# EAGLE design untitled (EAGLE 7.7.0)
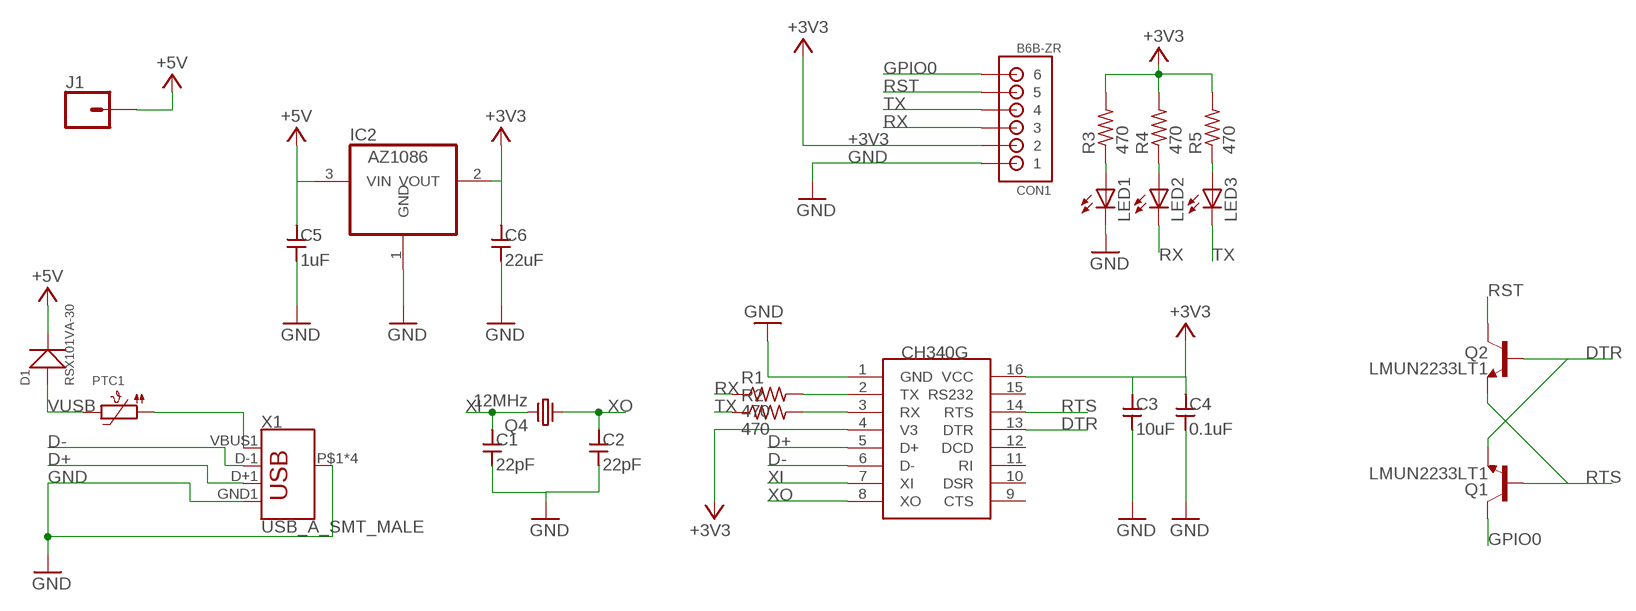
[diagram p0: schematic, sheet 1]

## Parts
C1  22pF  CAPACITOR1608  [SMD1608]
C2  22pF  CAPACITOR1608  [SMD1608]
C3  10uF  CAPACITOR1608  [SMD1608]
C4  0.1uF  CAPACITOR1608  [SMD1608]
C5  1uF  CAPACITOR1608  [SMD1608]
C6  22uF  CAPACITOR1608  [SMD1608]
CON1  B6B-ZR  [B6B-ZR]
D1  RSX101VA-30  DIODETUMD2  [TUMD2]
IC2  AZ1086  [SOT223]
J1  CONN_01PTH_NO_SILK_YES_STOP  [1X01_NO_SILK]
LED1  LEDCHIPLED_0603  [CHIPLED_0603]
LED2  LEDCHIPLED_0603  [CHIPLED_0603]
LED3  LEDCHIPLED_0603  [CHIPLED_0603]
PTC1  PTC0805  [0805]
Q1  LMUN2233LT1  [SOT23-3]
Q2  LMUN2233LT1  [SOT23-3]
Q4  12MHz  CRYSTAL-TC26H  [TC26H]
R1  470  R-US_R0603  [R0603]
R2  470  R-US_R0603  [R0603]
R3  470  R-US_R0603  [R0603]
R4  470  R-US_R0603  [R0603]
R5  470  R-US_R0603  [R0603]
U$1  CH340G  [SOIC16]
X1  USB_A_SMT_MALE  [USB-A-SMT-MALE]

## Nets
+3V3 [vcc]: C3.1 C4.1 C6.1 CON1.2 IC2.2(VOUT) R3.2 R4.2 R5.2 U$1.4(V3) U$1.16(VCC)
+5V [vcc]: C5.1 D1.- IC2.3(VIN) J1.1
D+: U$1.5(D+) X1.D+1(D+)
D-: U$1.6(D-) X1.D-1(D-)
DTR: Q1.3(E) Q2.1(B) U$1.13(DTR)
GND [gnd]: C1.2 C2.2 C3.2 C4.2 C5.2 C6.2 CON1.1 IC2.1(GND) LED1.C U$1.1(GND) X1.GND1(GND) X1.P$1(SHIELD) X1.P$2(SHIELD) X1.P$3(SHIELD) X1.P$4(SHIELD)
GPIO0: CON1.6 Q1.2(C)
N$1 [vcc]: PTC1.1 X1.VBUS1(VBUS)
N$2: LED1.A R3.1
N$3: LED2.A R4.1
N$4: LED3.A R5.1
RST: CON1.5 Q2.2(C)
RTS: Q1.1(B) Q2.3(E) U$1.14(RTS)
RX: CON1.3 LED2.C R1.1
RXD: R2.2 U$1.3(RX)
TX: CON1.4 LED3.C R2.1
TXD: R1.2 U$1.2(TX)
VUSB [vcc]: D1.+ PTC1.2
XI: C1.1 Q4.2 U$1.7(XI)
XO: C2.1 Q4.1 U$1.8(XO)
Unconnected: U$1.9(CTS) U$1.10(DSR) U$1.11(RI) U$1.12(DCD) U$1.15(RS232)

## Library data of the parts
C1-C6 = generic:CAPACITOR: Generic Capacitor
CON1 = jst-zh:B6B-ZR: JST-ZH Connector 6 pol, 1.5mm pitch Package: B6B-ZR Source: http://www.jst-mfg.com/product/pdf/eng/eZH.pdf
D1 = for-esp32-breakout:DIODE*
IC2 = akizuki:AZ1086: 1.5A LOW DROPOUT LINEAR REGULATOR 1.8V, 2.5V, 2.85V, 3.3V, 5V, and Adj; MPN: AZ1086
J1 = SparkFun-Connectors:CONN_01: Single connection point. Often used as Generic Header-pin footprint for 0.1 inch spaced/style header connections On any of the 0.1 inch spaced packages, you can populate with these: Break Away Headers - Straight <https://www.sparkfun.com/products/116> (PRT-00116) Break Away Male Headers - Right Angle <https://www.sparkfun.com/products/553> (PRT-00553) Female Headers <https://www.sparkfun.com/products/115> (PRT-00115) Break Away Headers - Machine Pin <https://www.sparkfun.com/products/117> (PRT-00117) Break Away Female Headers - Swiss Machine Pin <https://www.sparkfun.com/products/743> (PRT-00743) This device is also useful as a general connection point to wire up your design to another part of your project. Our various solder wires solder well into these plated through hole pads. Hook-Up Wire - Assortment (Stranded, 22 AWG) <https://www.sparkfun.com/products/11375> (PRT-11375) Hook-Up Wire - Assortment (Solid Core, 22 AWG) <https://www.sparkfun.com/products/11367> (PRT-11367) View the entire wire category on our website here <https://www.sparkfun.com/categories/141> Special notes: SMTSO-256-ET is a "flush mount" nut for a 4-40 screw. We mostly use this on specialty testbeds; it is a nice way to connect hardware to your PCB at an adjustable hieght. Also note, the SNAP packages are for using a snappable style connector. We sell a baggie of snaps and they are also used on two LilyPad designs: Snap Assortment - 30 pack (male and female) <https://www.sparkfun.com/products/11347> (DEV-11347) LilyPad Arduino SimpleSnap <https://www.sparkfun.com/products/10941> (DEV-10941) LilyPad SimpleSnap Protoboard <https://www.sparkfun.com/products/10940> (DEV-10940)
LED1-LED3 = adafruit:LED: LED OSRAM: - CHIPLED LG R971, LG N971, LY N971, LG Q971, LY Q971, LO R971, LY R971 LH N974, LH R974 LS Q976, LO Q976, LY Q976 LO Q996 - Hyper CHIPLED LW Q18S LB Q993, LB Q99A, LB R99A - SideLED LS A670, LO A670, LY A670, LG A670, LP A670 LB A673, LV A673, LT A673, LW A673 LH A674 LY A675 LS A676, LA A676, LO A676, LY A676, LW A676 LS A679, LY A679, LG A679 - Hyper Micro SIDELED® LS Y876, LA Y876, LO Y876, LY Y876 LT Y87S - SmartLED LW L88C, LW L88S LB L89C, LB L89S, LG L890 LS L89K, LO L89K, LY L89K LS L896, LA L896, LO L896, LY L896 - TOPLED LS T670, LO T670, LY T670, LG T670, LP T670 LSG T670, LSP T670, LSY T670, LOP T670, LYG T670 LG T671, LOG T671, LSG T671 LB T673, LV T673, LT T673, LW T673 LH T674 LS T676, LA T676, LO T676, LY T676, LB T676, LH T676, LSB T676, LW T676 LB T67C, LV T67C, LT T67C, LS T67K, LO T67K, LY T67K, LW E67C LS E67B, LA E67B, LO E67B, LY E67B, LB E67C, LV E67C, LT E67C LW T67C LS T679, LY T679, LG T679 LS T770, LO T770, LY T770, LG T770, LP T770 LB T773, LV T773, LT T773, LW T773 LH T774 LS E675, LA E675, LY E675, LS T675 LS T776, LA T776, LO T776, LY T776, LB T776 LHGB T686 LT T68C, LB T68C - Hyper Mini TOPLED® LB M676 - Mini TOPLED Santana® LG M470 LS M47K, LO M47K, LY M47K Source: http://www.osram.convergy.de/
PTC1 = microbuilder:PTC: PTC (Resettable Fuse) 1206 Package 250mA PTC (16V Max, Time-to-Trip: 0.08s) - Digikey: F2110CT-ND 1210 Package 100mA PTC (30V Max, Time-to-Trip: 0.6s) - Digikey: MF-USMF010-2CT-ND 1812 Package 750mA PTC (24V Max, Time-to-Trip: 0.2s) - Digikey: MF-MSMF075/24-2CT-ND
Q1 Q2 = for-esp-wroom-02:LMUN2233LT1
Q4 = crystal:CRYSTAL-: CRYSTAL
R1-R5 = resistor:R-US_: RESISTOR, American symbol
U$1 = ch340g:CH340G
X1 = aitendo:USB_A: USB-A Connector Male and female variants, as well as PTH and SMT variants SparkFun Products: SparkFun XBee Explorer Dongle <https://www.sparkfun.com/products/11697> PTH Male SparkFun MicroView-USB Programmer <https://www.sparkfun.com/products/12924> SMT Male SparkFun USB Type A Female Breakout <https://www.sparkfun.com/products/12700> SMT Female; PROD_ID: CONN-11499

## Net classes
0 default: width 0.254 mm, drill 0.305 mm, clearance 0.152 mm
1 gnd: width 0.635 mm, drill 0.635 mm, clearance 0.254 mm
2 vcc: width 0.813 mm, drill 0.813 mm, clearance 0.254 mm

## Board
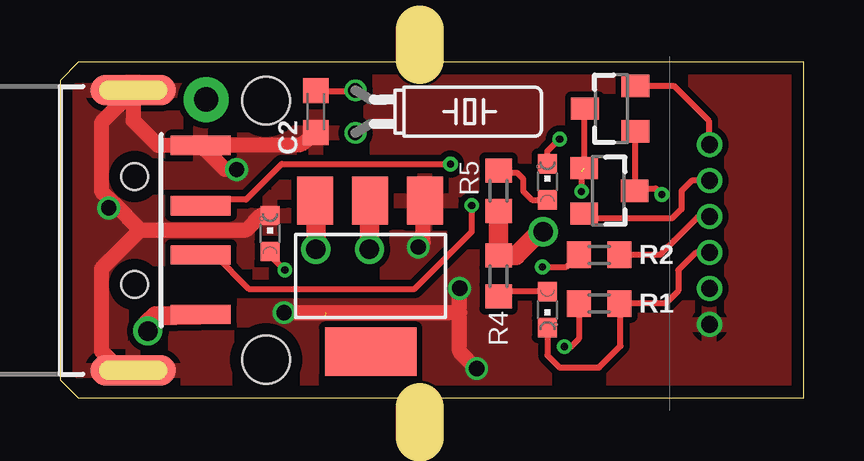
[diagram p1: board, top side]
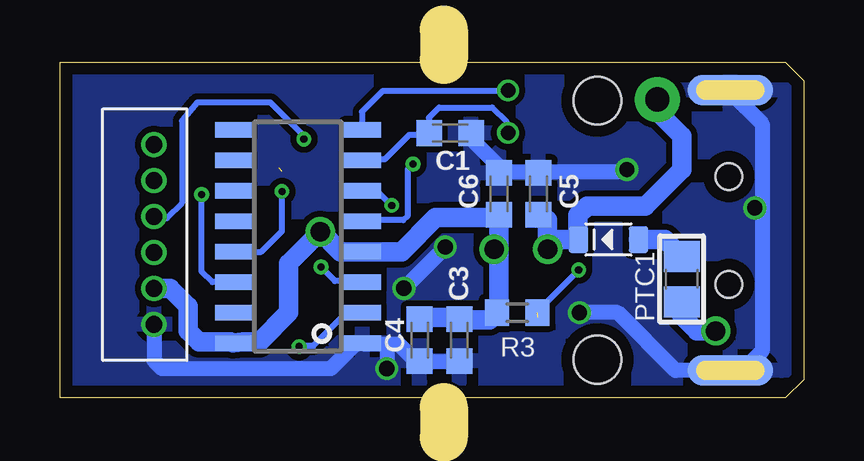
[diagram p2: board, bottom side, seen from below]

Size 31 x 14 mm. Coordinates in mm from the lower left corner, seen from the top.
Outline: 0.76,0 31,0 31,14 0.76,14 0,13.24 0,0.76 0.76,0
Copper layers (1*16): Top 0.035mm / dielectric 1.6mm / Bottom 0.035mm
Design rules "Elecrow_2-layer_PCB_eagle_rule": minimum track width 6mil, minimum drill 12mil, track to track 6mil, track to pad 6mil, pad to pad 6mil, via to via 8mil, smd to smd 0mil, copper to edge 20mil, drill to drill 10mil, minimum pad ring 6mil, minimum via ring 6mil, stop-mask expansion 0mil, vias tented up to drill 100mil, thermal gap 10mil
Holes 2 mm at 8.59,12.4 8.59,1.6
tRestrict: 2 lines
bRestrict: 2 lines
Milling: 2 lines

### Footprints (pad centres in the part's own frame; a part is rotated, then mirrored left to right if it is on the bottom)
SMD1608 = smd 1.05 x 1.08: 1 -0.875,0; 2 0.875,0
B6B-ZR = drill 0.7: 1 9,-1.3; 2 7.5,-1.3; 3 6,-1.3; 4 4.5,-1.3; 5 3,-1.3; 6 1.5,-1.3
TUMD2 = smd 0.8 x 1.1: + -1.25,0; - 1.25,0
SOT223 = smd 1.499 x 2.007: 1 -2.261,-3.15; 2 0.025,-3.15; 3 2.311,-3.15 | smd 3.81 x 2.007: 4 0,3.15
1X01_NO_SILK = drill 1.016 pad 1.88: 1 0,0
CHIPLED_0603 = smd 0.8 x 0.8: A 0,-0.75; C 0,0.75
0805 = smd 1.3 x 1.5: 1 -0.95,0; 2 0.95,0
SOT23-3 = smd 0.927 x 1.154: 1 -0.95,-1; 2 0.95,-1; 3 0,1.1
TC26H = drill 0.6: 1 -0.889,0; 2 0.889,0
R0603 = smd 1 x 1.1: 1 -0.85,0; 2 0.85,0
SOIC16 = smd 0.635 x 1.524: 1 -4.445,-2.695; 2 -3.175,-2.695; 3 -1.905,-2.695; 4 -0.635,-2.695; 5 0.635,-2.695; 6 1.905,-2.695; 7 3.175,-2.695; 8 4.445,-2.695; 9 4.445,2.695; 10 3.175,2.695; 11 1.905,2.695; 12 0.635,2.695; 13 -0.635,2.695; 14 -1.905,2.695; 15 -3.175,2.695; 16 -4.445,2.695
USB-A-SMT-MALE = smd 2.5 x 0.8: D+1 10.95,1.027; D-1 10.95,-1.027; GND1 10.95,3.551; VBUS1 10.95,-3.5 | smd 3.556 x 1.27: P$1 8.128,5.842; P$3 8.128,-5.842 | smd 3.556 x 1.27 bottom: P$2 8.128,5.842; P$4 8.128,-5.842 | hole 1.1: 8.2,2.25; 8.2,-2.25

### Placement (x,y rotation side)
C1  14.73,11.05 0 bottom
C2  10.67,11.94 270 top
C3  14.35,2.41 270 bottom
C4  16,2.41 270 bottom
C5  11.05,8.51 90 bottom
C6  12.7,8.51 90 bottom
CON1  25.78,12.06 270 bottom
D1  8.13,6.6 180 bottom
IC2  12.95,5.08 180 top
J1  6.1,12.45 0 top
LED1  8.76,6.86 0 top
LED2  20.32,3.68 180 top
LED3  20.32,9.02 0 top
PTC1  5.08,4.95 90 bottom
Q1  22.99,12.06 90 top
Q2  22.86,8.64 270 top
Q4  12.32,11.94 270 top
R1  22.48,3.94 180 top
R2  22.48,5.97 180 top
R3  11.94,3.56 180 bottom
R4  18.29,5.08 90 top
R5  18.29,8.64 270 top
U$1  21.08,6.73 90 bottom
X1  -5.08,6.99 0 top

### Tracks (layer width: path | path; a pad name or v marks a point on that pad's centre or on a via)
+3V3  (via drill 0.81)
  Top 0.813: R5.2 R4.2 19.01,5.93 20.02,6.93 v20.14,6.93 | v12.9,6.2 12.9,8.23 IC2.2
  Bottom 0.813: 12.7,6.2 C6.1 13.01,7.52 15.34,7.52 16.76,6.1 U$1.4 19.3,6.1 v20.14,6.93 21.46,5.61 21.46,3.56 22.68,2.34 23.37,2.34 U$1.16 23.88,2.34 25.2,2.34 25.65,2.79 25.65,3.81 26.41,4.57 CON1.2 | C4.1 15.95,3.35 14.73,3.35 C3.1 14.33,3.25 13.09,3.25 R3.2 12.7,3.64 12.7,6.2 | v12.9,6.2 12.7,6.2
+5V  (via drill 0.81)
  Top 0.813: v10.67,6.2 10.67,8.23 IC2.3
  Bottom 0.813: 10.97,7.72 C5.1 10.67,7.42 v10.67,6.2 10.26,6.6 D1.- 9.4,6.62 9.4,7.62 9.02,8 6.6,8 5.08,9.53 5.08,10.92 6.1,11.94 J1.1
D+  (via drill 0.3)
  Top 0.254: v16.28,9.75 9.25,9.75 7.76,8.27 6.12,8.27 X1.D+1
  Bottom 0.254: U$1.5 18.29,7.42 16.69,7.42 16.51,7.59 16.51,9.53 v16.28,9.75
D-  (via drill 0.3)
  Top 0.254: v17.17,8.03 17.17,6.93 14.78,4.55 7.87,4.55 6.46,5.96 X1.D-1
  Bottom 0.254: U$1.6 17.78,8.64 v17.17,8.03
DTR  (via drill 0.3)  (1 unrouted)
  Top 0.254: Q2.1 21.84,9.75 21.84,11.99 Q1.3 | 21.74,9.45 v21.74,8.61
  Bottom 0.254: U$1.13 22.61,6.1 21.74,6.96 v21.74,8.61
GND  (via drill 0.64)
  Top 0.635: v14.94,6.3 15.14,6.5 15.14,8.23 IC2.1 | 16.66,3.56 16.66,1.93 v17.37,1.22 | 16.66,3.56 v16.66,4.57 | 3.35,7.01 7.77,7.01 8.38,7.62 LED1.C | 2.23,8.13 1.73,8.64 1.73,11.48 3.05,12.8 X1.P$1 3.05,11.56 4.06,10.54 X1.GND1 | 2.23,8.13 3.35,7.01 | 5.23,10.57 5.79,10.57 | 5.79,10.57 X1.GND1 | 3.35,7.01 1.73,5.38 1.73,1.96 2.54,1.14 X1.P$4 | 10.87,10.97 C2.2 10.04,10.57 5.79,10.57 | v2.03,7.92 2.23,8.13 | v9.35,3.56 16.66,3.56 | v7.37,9.53 6.88,9.53 X1.GND1
  Bottom 0.635: C3.2 14.43,1.52 15.95,1.52 C4.2 16.26,1.63 16.87,2.23 17.37,2.23 | 17.37,2.23 18.29,2.23 U$1.1 18.69,2.23 19.71,1.22 26.75,1.22 27.08,1.55 CON1.1 | v16.66,4.57 v14.94,6.3 | 17.37,2.23 v17.37,1.22 | 11.07,9.45 12.7,9.45 C6.2 12.8,9.75 13.82,10.77 13.82,10.97 C1.2 | 11.07,9.45 C5.2 | 1.73,7.92 1.73,1.96 2.54,1.14 X1.P$4 5.33,1.14 7.75,3.56 v9.35,3.56 | v2.03,7.92 1.73,7.92 | 11.07,9.45 7.44,9.45 v7.37,9.53 | X1.P$1 3.05,12.75 1.73,11.43 1.73,7.92
  pour Top: 0,13.21 0,0.89 0,0.76 0.76,0 30.86,0 30.86,13.97 0.76,13.97
  pour Bottom: 0,13.21 0,0.76 0.76,0 30.86,0 30.86,13.97 0.76,13.97
GPIO0
  Top 0.254: Q1.2 25.59,13.02 27.05,11.56 27.05,10.6 CON1.6
N$1  (via drill 0.81)
  Top 0.813: X1.VBUS1 5.79,3.45 3.99,3.43 3.66,3.1 v3.66,2.79
  Bottom 0.813: v3.66,2.79 4.45,2.79 5.08,3.43 PTC1.1
N$2  (via drill 0.3)  (1 unrouted)
  Top 0.254: v9.37,5.33 8.76,5.94 LED1.A
  Bottom 0.254: 11.07,3.35 11.07,3.63 v9.37,5.33
N$3
  Top 0.254: LED2.A 18.49,4.43 R4.1
N$4
  Top 0.254: LED3.A 20.31,8.26 19.68,8.26 19.3,8.64 19.3,9.14 19.05,9.4 18.38,9.4 R5.1
RST
  Top 0.254: Q2.2 21.95,7.82 22.28,7.49 25.53,7.49 25.91,7.87 25.91,8.64 26.34,9.06 CON1.5
RTS  (via drill 0.3)
  Top 0.254: Q1.1 24.08,11.07 23.96,10.96 Q2.3 23.98,8.74 24.84,8.74 v25.09,8.48
  Bottom 0.254: U$1.14 24.64,4.83 25.09,5.28 v25.09,8.48
RX
  Top 0.254: 23.37,4.27 R1.1 | 23.37,4.15 R1.1 | R1.1 25.26,3.94 25.78,4.46 25.78,5.33 26.51,6.07 CON1.3 | LED2.C 20.32,1.78 20.83,1.27 22.48,1.27 23.37,2.16 23.37,3.9 R1.1
RXD  (via drill 0.3)
  Top 0.254: v20.12,5.46 21.12,5.46 R2.2
  Bottom 0.254: U$1.3 18.39,4.88 19.53,4.88 v20.12,5.46
TX  (via drill 0.3)
  Top 0.254: R2.1 24.13,5.97 24.77,5.97 25.02,5.97 26.61,7.57 CON1.4 | LED3.C 20.32,10.29 v20.83,10.79
  Bottom 0.254: v20.83,10.79 20.83,10.92 22.23,12.32 25.27,12.32 25.91,11.56 25.91,8.13 26.54,7.49 27.01,7.49 CON1.4
TXD  (via drill 0.3)
  Top 0.254: 21.54,4.17 R1.2 21.63,2.45 21.31,2.13 v21.03,2.13
  Bottom 0.254: U$1.2 19.05,3.56 20.45,2.16 21.01,2.16 v21.03,2.13
VUSB
  Bottom 0.813: D1.+ 5.78,6.6 PTC1.2
XI
  Bottom 0.254: U$1.7 18.29,9.96 17.45,9.96 16.43,10.97 15.65,10.97 C1.1 15.62,11.06 15.62,11.68 15.19,12.12 12.98,12.12 12.39,11.53 12.39,11.07 Q4.2
XO
  Top 0.254: C2.1 10.87,12.8 12.29,12.8 Q4.1
  Bottom 0.254: 12.29,12.8 Q4.1 12.39,12.8 17.55,12.8 18.41,11.94 18.41,11.2 U$1.8

### Text on the board
tValues: IO0 | RST | TX | RX | 3V | Rev.2 | GND
bValues: 5V